# Altium project ArduinoProMini_Project.PrjPcb
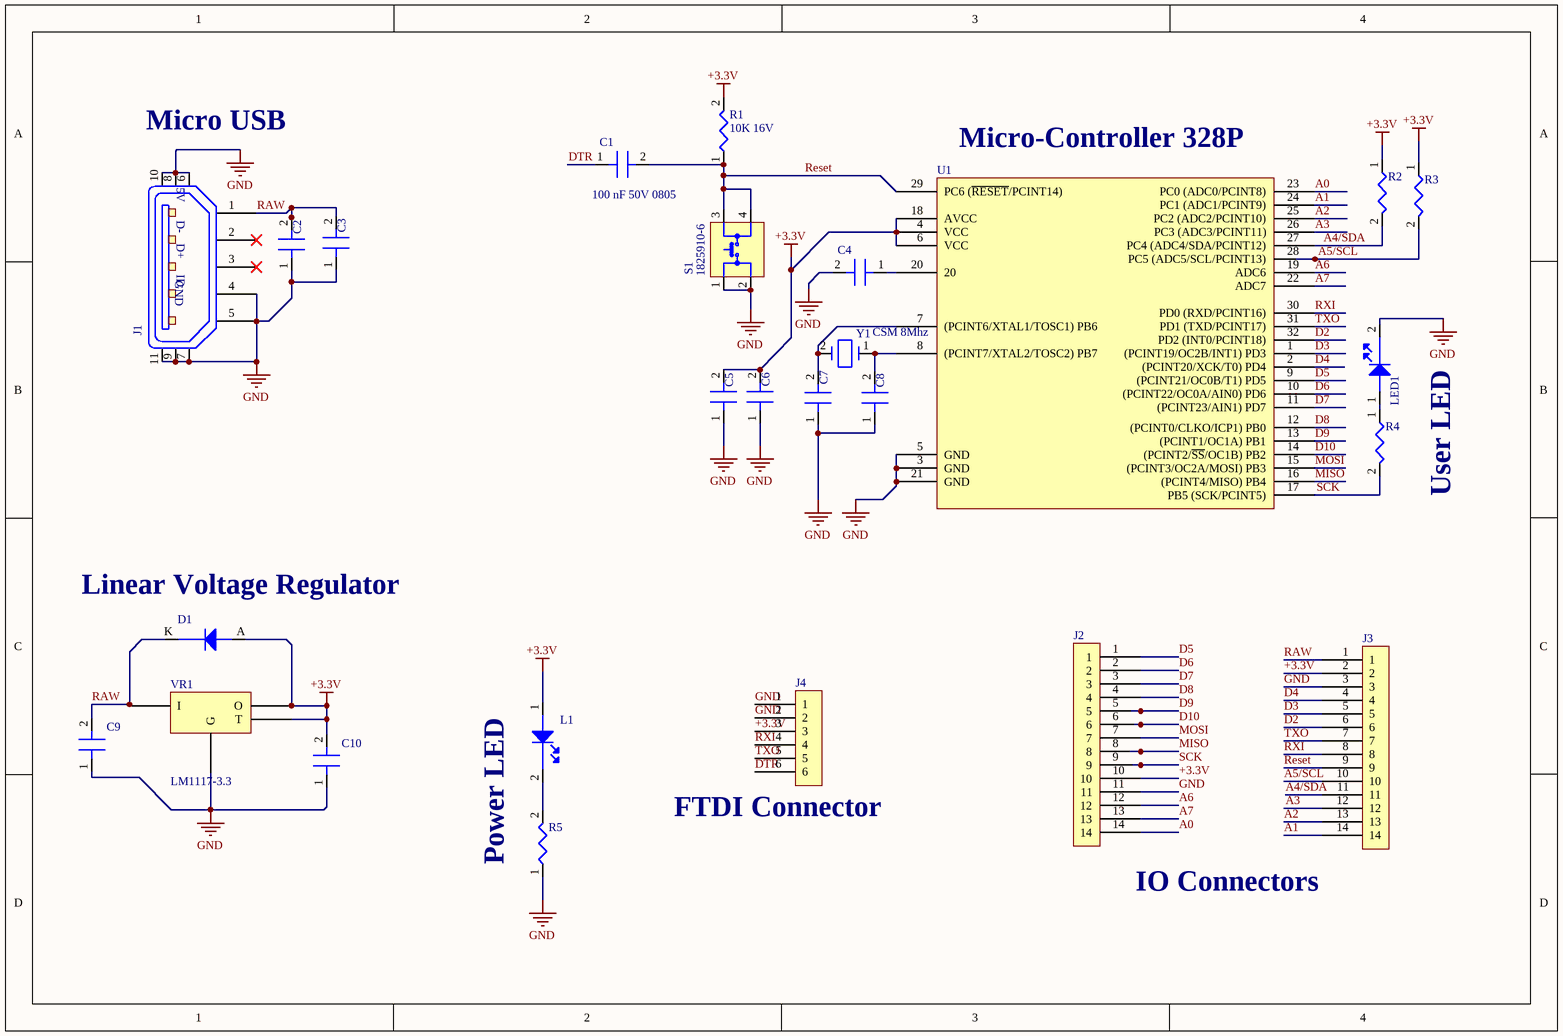
[diagram p0: ArduinoProMini_Schematic.SchDoc]
1 sheet, 26 parts. Net scope: global (net labels, ports and power ports of the same name join across sheets).
Board file: ArduinoProMini_PCB.PcbDoc

## Sheet ArduinoProMini_Schematic.SchDoc
size A4; SheetNumber: 1; SheetTotal: 1

### Parts
C1  100 nF 50V 0805  [C 0805]
C2  100nF  [C 0805]  (value not drawn)
C3  100nF  [C 0805]  (value not drawn)
C4  100 nF 50V 0805  [C 0805]  (value not drawn)
C5  100 nF 50V 0805  [C 0805]  (value not drawn)
C6  100 nF 50V 0805  [C 0805]  (value not drawn)
C7  18pF  [C 0805]  (value not drawn)
C8  18pF  [C 0805]  (value not drawn)
C9  10uF 16V  [C 0805]  (value not drawn)
C10  10uF  [C 0805]  (value not drawn)
D1  1N4148  [DIode 1N4148]  (value not drawn)
J1  (no value)  [Micro-USB-Type-B-FP]
J2  Header 1*14 Male 2.54  [Header Male 1x14 2.54]  (value not drawn)
J3  Header 1*14 Male 2.54  [Header Male 1x14 2.54]  (value not drawn)
J4  Header 1*6 Female  [Header Female 1x6-254]  (value not drawn)
L1  LED Blue 0603  [LED 0603]  (value not drawn)
LED1  LED White 0603  [LED 0603]  (value not drawn)
R1  10K 16V  [R 0805]
R2  10K 16V  [R 0805]  (value not drawn)
R3  10K 16V  [R 0805]  (value not drawn)
R4  330R 150V  [R 0805]  (value not drawn)
R5  330R 150V  [R 0805]  (value not drawn)
S1  1825910-6  [SW-1825910-6]
U1  ATMEGA328P-AUR  [TQFP-32]  (value not drawn)
VR1  LM1117-3.3  [LM1117-SOT223]
Y1  CSM 8Mhz  [Crystal CSM-7X]

### Nets
+3.3V: C5.2 C6.2 C10.2 D1.A(anode) J2.10 J3.2 J4.3 L1.1(anode) R1.2 R2.1 R3.1 U1.4(VCC) U1.6(VCC) U1.18(AVCC) VR1.2(O) VR1.4(T)
GND: C2.1 C3.1 C4.2 C5.1 C6.1 C7.1 C8.1 C9.1 C10.1 J1.4 J1.5 J1.6 J1.7 J1.8 J1.9 J1.10 J1.11 J2.11 J3.3 J4.1 J4.2 LED1.2(cathode) R5.1 S1.1 S1.2 U1.3(GND) U1.5(GND) U1.21(GND) VR1.1(G)
A0: J2.14 U1.23(PC0_(ADC0/PCINT8))
A1: J3.14 U1.24(PC1_(ADC1/PCINT9))
A2: J3.13 U1.25(PC2_(ADC2/PCINT10))
A3: J3.12 U1.26(PC3_(ADC3/PCINT11))
A4/SDA: J3.11 R2.2 U1.27(PC4_(ADC4/SDA/PCINT12))
A5/SCL: J3.10 R3.2 U1.28(PC5_(ADC5/SCL/PCINT13))
A6: J2.12 U1.19(ADC6)
A7: J2.13 U1.22(ADC7)
D2: J3.6 U1.32(PD2_(INT0/PCINT18))
D3: J3.5 U1.1((PCINT19/OC2B/INT1)_PD3)
D4: J3.4 U1.2((PCINT20/XCK/T0)_PD4)
D5: J2.1 U1.9((PCINT21/OC0B/T1)_PD5)
D6: J2.2 U1.10((PCINT22/OC0A/AIN0)_PD6)
D7: J2.3 U1.11((PCINT23/AIN1)_PD7)
D8: J2.4 U1.12((PCINT0/CLKO/ICP1)_PB0)
D9: J2.5 U1.13((PCINT1/OC1A)_PB1)
D10: J2.6 U1.14((PCINT2/~{SS}/OC1B)_PB2)
DTR: C1.1 J4.6
MISO: J2.8 U1.16((PCINT4/MISO)_PB4)
MOSI: J2.7 U1.15((PCINT3/OC2A/MOSI)_PB3)
RAW: C2.2 C3.2 C9.2 D1.K(cathode) J1.1 J3.1 VR1.3(I)
Reset: C1.2 J3.9 R1.1 S1.3 S1.4 U1.29(PC6_(~{RESET}/PCINT14))
RXI: J3.8 J4.4 U1.30(PD0_(RXD/PCINT16))
SCK: J2.9 R4.2 U1.17(PB5_(SCK/PCINT5))
TXO: J3.7 J4.5 U1.31(PD1_(TXD/PCINT17))
NetC4_1: C4.1 U1.20
NetC7_2: C7.2 U1.7((PCINT6/XTAL1/TOSC1)_PB6) Y1.2
NetC8_2: C8.2 U1.8((PCINT7/XTAL2/TOSC2)_PB7) Y1.1
NetL1_2: L1.2(cathode) R5.2
NetLED1_1: LED1.1(anode) R4.1

Not connected (* = marked no-connect by the designer): J1 2* 3*

### Notes on the sheet
- (near J1) Micro USB
- (near U1) Micro-Controller 328P
- User LED
- (near D1) Linear Voltage Regulator
- (near J4) FTDI Connector
- Power LED
- IO Connectors
- (in symbol Micro-USB-Type-B-SCH) 5V; D-; D+; ID; GND

### Library data of the parts
C1 C4-C6 = C0805C104Z5VACTU: Multilayer Ceramic Capacitor, 0.1 uF, 50 V, -20%, +80%, Y5V, 0805 [2012 Metric]; Manufacturer: KEMET; Material: 4241ConductorMaterial; Value: 100nF; Tolerance: 80%; Dissipation Factor: 5%; Supplier: Digikey; Supplier Part Number: 399-C0805C104Z5VAC7800CT-ND; Manufacturer Part Number: C0805C104Z5VACTU; RoHS: Yes; Category: Ceramic Capacitors; Stock: 411669; Pricing: 1=0.1, 10=0.043, 50=0.0248, 100=0.0193, 500=0.0145, 1000=0.01139 (USD); Mounting Technology: Surface Mount,PCB; Case/Package: 0805; Pins: 2NUMBER; Case Code (Metric): 2012; Case Code (Imperial): 0805; Dielectric Material: Ceramic; Min Operating Temperature: -30°C; Max Operating Temperature: 85°C; Package Quantity: 1; Voltage Rating: 50V; Packaging: Tape and Reel; Voltage Rating (DC): 50V; Dielectric: Y5V; Termination: SMD/SMT; Voltage: 50V; Series: C0805C; Construction: Flat; Length: 2mm; Width: 0.049inch; Height: 0.9mm; Thickness: 0.039inch; Lead Pitch: 0.75mm; Depth: 1.25mm; Radiation Hardening: No; Reach SVHC Compliant: No; RoHS Compliant: Yes; Lead Free: 5697LeadFree; ComponentLink1URL: https://datasheet.ciiva.com/7842/1470417-7842543.pdf?src-supplier=Element14; ComponentLink1Description: https://datasheet.ciiva.com/7842/1470417-7842543.pdf?src-supplier=Element14; ComponentLink2URL: https://datasheet.ciiva.com/14608/70095383-14608251.pdf?src-supplier=Allied+Electronics; ComponentLink2Description: https://datasheet.ciiva.com/14608/70095383-14608251.pdf?src-supplier=Allied+Electronics; ComponentLink3URL: https://datasheet.ciiva.com/14597/70095383-14597846.pdf?src-supplier=Allied+Electronics; ComponentLink3Description: https://datasheet.ciiva.com/14597/70095383-14597846.pdf?src-supplier=Allied+Electronics; ComponentLink4URL: https://datasheet.ciiva.com/26847/getdatasheetpartid-321176-26847799.pdf?src-supplier=Verical; ComponentLink4Description: https://datasheet.ciiva.com/26847/getdatasheetpartid-321176-26847799.pdf?src-supplier=Verical
C2 C3 = C0805C104Z5VACTU: Multilayer Ceramic Capacitor, 0.1 uF, 50 V, -20%, +80%, Y5V, 0805 [2012 Metric]; Manufacturer: KEMET; Material: 4241ConductorMaterial; Voltage Rating: 50V; Tolerance: 80%; Dissipation Factor: 5%; Supplier: Digikey; Supplier Part Number: 399-C0805C104Z5VAC7800CT-ND; Manufacturer Part Number: C0805C104Z5VACTU; RoHS: Yes; Category: Ceramic Capacitors; Stock: 411669; Pricing: 1=0.1, 10=0.043, 50=0.0248, 100=0.0193, 500=0.0145, 1000=0.01139 (USD); Mounting Technology: Surface Mount,PCB; Case/Package: 0805; Pins: 2NUMBER; Case Code (Metric): 2012; Case Code (Imperial): 0805; Dielectric Material: Ceramic; Min Operating Temperature: -30°C; Max Operating Temperature: 85°C; Package Quantity: 1; Value: 100nF; Packaging: Tape and Reel; Voltage Rating (DC): 50V; Dielectric: Y5V; Termination: SMD/SMT; Voltage: 50V; Series: C0805C; Construction: Flat; Length: 2mm; Width: 0.049inch; Height: 0.9mm; Thickness: 0.039inch; Lead Pitch: 0.75mm; Depth: 1.25mm; Radiation Hardening: No; Reach SVHC Compliant: No; RoHS Compliant: Yes; Lead Free: 5697LeadFree; ComponentLink1URL: https://datasheet.ciiva.com/7842/1470417-7842543.pdf?src-supplier=Element14; ComponentLink1Description: https://datasheet.ciiva.com/7842/1470417-7842543.pdf?src-supplier=Element14; ComponentLink2URL: https://datasheet.ciiva.com/14608/70095383-14608251.pdf?src-supplier=Allied+Electronics; ComponentLink2Description: https://datasheet.ciiva.com/14608/70095383-14608251.pdf?src-supplier=Allied+Electronics; ComponentLink3URL: https://datasheet.ciiva.com/14597/70095383-14597846.pdf?src-supplier=Allied+Electronics; ComponentLink3Description: https://datasheet.ciiva.com/14597/70095383-14597846.pdf?src-supplier=Allied+Electronics; ComponentLink4URL: https://datasheet.ciiva.com/26847/getdatasheetpartid-321176-26847799.pdf?src-supplier=Verical; ComponentLink4Description: https://datasheet.ciiva.com/26847/getdatasheetpartid-321176-26847799.pdf?src-supplier=Verical
C7 C8 = CC0805JRNPO9BN180: Multilayer Ceramic Capacitor, 18 pF, 50 V, ± 5%, C0G (NP0), 0805 [2012 Metric]; Manufacturer: Yageo; Supplier: Future Electronics; Supplier Part Number: 7642911; Manufacturer Part Number: CC0805JRNPO9BN180; RoHS: Yes; Category: Ceramic Capacitors; Stock: 232000; Pricing: 4000=0.0082, 16000=0.0078, 60000=0.0075, 100000=0.0073, 200000=0.0069 (USD); Lead Free: 5697LeadFree; Halogen Free: 5694HalogenFree; ComponentLink1URL: https://datasheet.ciiva.com/26862/getdatasheetpartid-403658-26862933.pdf?src-supplier=Verical; ComponentLink1Description: https://datasheet.ciiva.com/26862/getdatasheetpartid-403658-26862933.pdf?src-supplier=Verical; ComponentLink2URL: https://datasheet.ciiva.com/144/mlccorderingcode-144754.pdf?src-supplier=Digikey; ComponentLink2Description: https://datasheet.ciiva.com/144/mlccorderingcode-144754.pdf?src-supplier=Digikey; ComponentLink3URL: https://datasheet.ciiva.com/144/mlccorderingcode-144755.pdf?src-supplier=Digikey; ComponentLink3Description: https://datasheet.ciiva.com/144/mlccorderingcode-144755.pdf?src-supplier=Digikey; ComponentLink4URL: https://datasheet.ciiva.com/144/mlccorderingcode-144756.pdf?src-supplier=Digikey; ComponentLink4Description: https://datasheet.ciiva.com/144/mlccorderingcode-144756.pdf?src-supplier=Digikey; ComponentLink5URL: https://datasheet.ciiva.com/11586/upy-gp-np0-16v-to-50v-8-11586203.pdf?src-supplier=Avnet; ComponentLink5Description: https://datasheet.ciiva.com/11586/upy-gp-np0-16v-to-50v-8-11586203.pdf?src-supplier=Avnet
C9 = C0805C106K4PACTU: Multilayer Ceramic Capacitor, 10 uF, 16 V, ± 10%, X5R, 0805 [2012 Metric]; Manufacturer: KEMET; Material: 4241ConductorMaterial; Dissipation Factor: 5%; Supplier: Digikey; Supplier Part Number: 399-C0805C106K4PAC7800CT-ND; Manufacturer Part Number: C0805C106K4PACTU; RoHS: Yes; Category: Ceramic Capacitors; Stock: 211297; Pricing: 1=0.17, 10=0.109, 50=0.069, 100=0.0553, 500=0.03992, 1000=0.03531 (USD); Mounting Technology: Surface Mount; Case/Package: 0805; Pins: 2; Dielectric Material: Ceramic; Case Code (Imperial): 0805; Case Code (Metric): 2012; Min Operating Temperature: -55°C; Max Operating Temperature: 85°C; Value: 10uF; Tolerance: 10%; Packaging: Tape and Reel; Dielectric: X5R; Voltage: 16V; Termination: SMD/SMT; Package Quantity: 1; Voltage Rating: 16V; Series: C; Construction: Flat; Voltage Rating (DC): 16V; Length: 2mm; Width: 0.049inch; Height: 1.25mm; Depth: 1.25mm; Thickness: 0.055inch; Radiation Hardening: No; Reach SVHC Compliant: No; RoHS Compliant: Yes; Lead Free: 5697LeadFree; ComponentLink1URL: https://datasheet.ciiva.com/7842/1732713-7842196.pdf?src-supplier=Element14; ComponentLink1Description: https://datasheet.ciiva.com/7842/1732713-7842196.pdf?src-supplier=Element14; ComponentLink2URL: https://datasheet.ciiva.com/28682/1831760-28682305.pdf?src-supplier=Element14; ComponentLink2Description: https://datasheet.ciiva.com/28682/1831760-28682305.pdf?src-supplier=Element14; ComponentLink3URL: https://datasheet.ciiva.com/11787/0900766b8116eb59-11787314.pdf?src-supplier=Rs; ComponentLink3Description: https://datasheet.ciiva.com/11787/0900766b8116eb59-11787314.pdf?src-supplier=Rs; ComponentLink4URL: https://datasheet.ciiva.com/7842/1732713-7842197.pdf?src-supplier=Element14; ComponentLink4Description: https://datasheet.ciiva.com/7842/1732713-7842197.pdf?src-supplier=Element14
C10 = C0805C106K4PACTU: Multilayer Ceramic Capacitor, 10 uF, 16 V, ± 10%, X5R, 0805 [2012 Metric]; Manufacturer: KEMET; Material: 4241ConductorMaterial; Voltage: 16V; Dissipation Factor: 5%; Supplier: Digikey; Supplier Part Number: 399-C0805C106K4PAC7800CT-ND; Manufacturer Part Number: C0805C106K4PACTU; RoHS: Yes; Category: Ceramic Capacitors; Stock: 211297; Pricing: 1=0.17, 10=0.109, 50=0.069, 100=0.0553, 500=0.03992, 1000=0.03531 (USD); Mounting Technology: Surface Mount; Case/Package: 0805; Pins: 2; Dielectric Material: Ceramic; Case Code (Imperial): 0805; Case Code (Metric): 2012; Min Operating Temperature: -55°C; Max Operating Temperature: 85°C; Value: 10uF; Tolerance: 10%; Packaging: Tape and Reel; Dielectric: X5R; Termination: SMD/SMT; Package Quantity: 1; Voltage Rating: 16V; Series: C; Construction: Flat; Voltage Rating (DC): 16V; Length: 2mm; Width: 0.049inch; Height: 1.25mm; Depth: 1.25mm; Thickness: 0.055inch; Radiation Hardening: No; Reach SVHC Compliant: No; RoHS Compliant: Yes; Lead Free: 5697LeadFree; ComponentLink1URL: https://datasheet.ciiva.com/7842/1732713-7842196.pdf?src-supplier=Element14; ComponentLink1Description: https://datasheet.ciiva.com/7842/1732713-7842196.pdf?src-supplier=Element14; ComponentLink2URL: https://datasheet.ciiva.com/28682/1831760-28682305.pdf?src-supplier=Element14; ComponentLink2Description: https://datasheet.ciiva.com/28682/1831760-28682305.pdf?src-supplier=Element14; ComponentLink3URL: https://datasheet.ciiva.com/11787/0900766b8116eb59-11787314.pdf?src-supplier=Rs; ComponentLink3Description: https://datasheet.ciiva.com/11787/0900766b8116eb59-11787314.pdf?src-supplier=Rs; ComponentLink4URL: https://datasheet.ciiva.com/7842/1732713-7842197.pdf?src-supplier=Element14; ComponentLink4Description: https://datasheet.ciiva.com/7842/1732713-7842197.pdf?src-supplier=Element14
D1 = 1N4148UR-1: Rectifier Diode Switching 75V 0.2A 5ns 2-Pin DO-213AA Bag; Manufacturer: Microsemi; Forward Current: 200mA; Supplier: Newark; Supplier Part Number: 34AJ8178; Manufacturer Part Number: 1N4148UR-1; RoHS: No; Category: Uncategorized; Max Repetitive Reverse Voltage (Vrrm): 75V; Reverse Recovery Time-Max: 5ns; Lead Free: Lead Free; ComponentLink1URL: https://datasheet.ciiva.com/3304/lds-0281-1-3304223.pdf?src-supplier=Avnet; ComponentLink1Description: https://datasheet.ciiva.com/3304/lds-0281-1-3304223.pdf?src-supplier=Avnet
J1 = Micro-USB-Type-B-SCH: CONN USB MICRO B RECPT SMT R/A; Manufacturer: Amphenol ICC / FCI; Manufacturer Part Number: 10118194-0001LF; Connector Type: USB,Receptacle; Number of Contacts: 5; Gender: Receptacle; Current Rating: 1.8A; Insulation Resistance: 1GR; Number of Ports: 1; Max Voltage Rating (AC): 100V; Supplier: Rs; Supplier Part Number: 1370829; RoHS: No; Category: LDO; Stock: 4420; Pricing: 1200=0.225, 2400=0.219 (EUR); Mounting Technology: Surface Mount,Horizontal; Pins: 5; Color: Black; Contact Material: Copper Alloy; Contact Plating: Gold; Housing Material: Polymer; Min Operating Temperature: -55°C; Max Operating Temperature: 85°C; Features: Shielded; Packaging: Tape and Reel; Termination: Solder; Orientation: Right Angle; Series: -; Package Quantity: 9600; Length: 8.05mm; Depth: 5mm; Flammability Rating: UL94 V-0
J2 J3 = PH1-14-UA: Conn Unshrouded Header HDR 14 POS 2.54mm Solder ST Thru-Hole Bag; Manufacturer: Adam Equipment; Number of Positions: 14; Voltage Rating (AC): 250V; Supplier: Future Electronics; Supplier Part Number: 9109416; Manufacturer Part Number: PH1-14-UA; RoHS: Yes; Category: Connectors; Stock: 12000; Pricing: 1000=0.0993, 3000=0.0952, 5000=0.0934, 15000=0.0895, 25000=0.0862 (USD); Mounting Technology: Through Hole; Contact Material: Brass; Contact Shape: Square; Contact Finish - Mating: GOLD; Insulation Material: PBT; Insulation Color: Black; Min Operating Temperature: -40°C; Max Operating Temperature: 105°C; Connector Type: Header; Fastening Type: Pull; Series: PH1; Packaging: Bulk; Contact Type: Male Pin; Number of Rows: 1; Termination: Solder; Lead Free: Lead Free; Flammability Rating: UL94 V-0; ComponentLink1URL: https://datasheet.ciiva.com/16480/catpg250-254-16480235.pdf?src-supplier=Future+Electronics; ComponentLink1Description: https://datasheet.ciiva.com/16480/catpg250-254-16480235.pdf?src-supplier=Future+Electronics
J4 = M20-7820646: 2.54mm (0.1") Pitch SIL Vertical PC Tail Socket Assembly, tin, 6 contacts; Manufacturer: Harwin; Number of Positions: 6; Voltage Rating: 1kV; Connector Type: Receptacle; Mated Stacking Heights: 12.63mm; Supplier: Rs; Supplier Part Number: 1613515; Manufacturer Part Number: M20-7820646; RoHS: Yes; Category: Headers and Wire Housings; Stock: 396; Pricing: 36=0.938, 180=0.875, 360=0.781, 720=0.704 (EUR); Mounting Technology: Through Hole; Case/Package: SIL; Contact Plating: Tin; Contact Material: Bronze; Contact Finish - Mating: TIN; Insulation Color: Black; Insulation Material: Nylon; Contact Shape: Square; Min Operating Temperature: -40°C; Max Operating Temperature: 105°C; Packaging: Rail/Tube; Number of Rows: 1; Termination: Solder; Series: M20; Package Quantity: 38; Number of Contacts: 6; Contact Type: Female Socket; Fastening Type: Pull; Contact Gender: Female; Pitch: 2.54mm; Radiation Hardening: No; RoHS Compliant: Yes; Flammability Rating: UL94 V-0; ComponentLink1URL: https://cdn.harwin.com/pdfs/Harwin_PC_Connectors_M20.pdf?src-supplier=Rs; ComponentLink1Description: https://cdn.harwin.com/pdfs/Harwin_PC_Connectors_M20.pdf?src-supplier=Rs; ComponentLink2URL: http://www.harwin.com/include/downloads/pdfs/2010PAGE120.PDF?src-supplier=Avnet; ComponentLink2Description: http://www.harwin.com/include/downloads/pdfs/2010PAGE120.PDF?src-supplier=Avnet; ComponentLink3URL: https://cdn.harwin.com/pdfs/M20-782.pdf?src-supplier=Digikey; ComponentLink3Description: https://cdn.harwin.com/pdfs/M20-782.pdf?src-supplier=Digikey; ComponentLink4URL: https://cdn.harwin.com/pdfs/Harwin_PC_Connectors_M20.pdf?src-supplier=Mouser; ComponentLink4Description: https://cdn.harwin.com/pdfs/Harwin_PC_Connectors_M20.pdf?src-supplier=Mouser; ComponentLink5URL: https://cdn.harwin.com/pdfs/Harwin_PC_Connectors_M20.pdf?src-supplier=TTI; ComponentLink5Description: https://cdn.harwin.com/pdfs/Harwin_PC_Connectors_M20.pdf?src-supplier=TTI
L1 = LTST-C194TBKT: LED BLUE CLEAR 0603 SMD; Manufacturer: Vishay Lite-On; Supplier: Rs; Supplier Part Number: 1278417; Manufacturer Part Number: LTST-C194TBKT; RoHS: Yes; Category: LEDs; Stock: 8750; Pricing: 50=0.208, 750=0.092, 1500=0.069, 3000=0.066, 6000=0.058 (EUR); ComponentLink1URL: https://datasheet.ciiva.com/2115/ltst-c194tbkt-2115056.pdf?src-supplier=Digikey; ComponentLink1Description: https://datasheet.ciiva.com/2115/ltst-c194tbkt-2115056.pdf?src-supplier=Digikey; ComponentLink2URL: https://datasheet.ciiva.com/4689/lite-on-ltst-c194tbkt-187209-4689177.pdf?src-supplier=Mouser; ComponentLink2Description: https://datasheet.ciiva.com/4689/lite-on-ltst-c194tbkt-187209-4689177.pdf?src-supplier=Mouser; ComponentLink3URL: https://datasheet.ciiva.com/2115/s-110-ltst-c194tbkt-2115057.pdf?src-supplier=Digikey; ComponentLink3Description: https://datasheet.ciiva.com/2115/s-110-ltst-c194tbkt-2115057.pdf?src-supplier=Digikey
LED1 = IN-S63AT5UW: SMD LED - Mono Color Top View, 0603 0.40mm LED PCB Type, White, High Brightness, Clear Lens, Angle 120; Manufacturer: Inolux; Lens Style: Flat; Luminous Intensity: 900mcd; Forward Voltage: 3V; Test Current: 5mA; Viewing Angle: 120°; Power Dissipation: 75mW; Reverse Voltage: 5V; Lens Size: 0.8mm; Supplier: Mouser; Supplier Part Number: 743-IN-S63AT5UW; Manufacturer Part Number: IN-S63AT5UW; RoHS: Yes; Category: LEDs; Stock: 170396; Pricing: 1=0.33, 10=0.177, 50=0.177, 100=0.076, 1000=0.059, 10000=0.044 (USD); Mounting Technology: Surface Mount; Case/Package: 0603; Color: White; Lens Color: Clear; Case Code (Imperial): 0603; Case Code (Metric): 1608; Min Operating Temperature: -40°C; Max Operating Temperature: 85°C; Packaging: Tape and Reel; Lens Transparency: Clear; Forward Current: 5mA; Length: 1.6mm; Width: 0.8mm; Height: 0.4mm; ComponentLink1URL: http://www.inolux-corp.com/datasheet/SMDLED/Mono%20Color%20Top%20View/IN-S63AT%20Series_V1.1.pdf?src-supplier=Digikey; ComponentLink1Description: http://www.inolux-corp.com/datasheet/SMDLED/Mono%20Color%20Top%20View/IN-S63AT%20Series_V1.1.pdf?src-supplier=Digikey
R1-R3 = RC0805FR-0710KL: SMD Chip Resistor, 10 kOhm, ± 1%, 125 mW, 0805 [2012 Metric], Thick Film, General Purpose; Manufacturer: Yageo; Value: 10kR; Temperature Coefficient: 100ppm/°C; Power Rating: 125mW; Voltage Rating: 150V; Supplier: Future Electronics; Supplier Part Number: 3310877; Manufacturer Part Number: RC0805FR-0710KL; RoHS: Yes; Category: Chip SMD Resistors; Stock: 1020000; Pricing: 5000=0.004, 25000=0.0038, 150000=0.0035, 500000=0.0034, 1500000=0.0031 (USD); Case/Package: 0805; Case Code (Imperial): 0805; Case Code (Metric): 2012; Min Operating Temperature: -55°C; Max Operating Temperature: 155°C; Packaging: Tape and Reel; Tolerance: 1%; Resistor Type: Thick Film; Package Quantity: 1; Termination: SMD/SMT; Number of Terminations: 2; Max Power Dissipation: 125mW; Features: Moisture Resistant; Series: RC; Construction: Rectangular; Resistance Tolerance: 1%; Technology: THICK FILM; Voltage Rating (AC): 150V; Length: 0.079inch; Width: 0.049inch; Height: 0.024inch; Depth: 1.25mm; Lead Free: Lead Free; Reach SVHC Compliant: Unknown; Military Standard: Not; RoHS Compliant: Yes; ComponentLink1URL: https://datasheet.ciiva.com/2456/pyu-r-int-thick-7-2456973.pdf?src-supplier=Digikey; ComponentLink1Description: https://datasheet.ciiva.com/2456/pyu-r-int-thick-7-2456973.pdf?src-supplier=Digikey; ComponentLink2URL: https://datasheet.ciiva.com/2456/pyu-r-int-thick-7-2456974.pdf?src-supplier=Digikey; ComponentLink2Description: https://datasheet.ciiva.com/2456/pyu-r-int-thick-7-2456974.pdf?src-supplier=Digikey; ComponentLink3URL: https://datasheet.ciiva.com/12669/rc0805-12669688.pdf?src-supplier=Mouser; ComponentLink3Description: https://datasheet.ciiva.com/12669/rc0805-12669688.pdf?src-supplier=Mouser; ComponentLink4URL: https://datasheet.ciiva.com/16747/rc0805-16747087.pdf?src-supplier=Future+Electronics; ComponentLink4Description: https://datasheet.ciiva.com/16747/rc0805-16747087.pdf?src-supplier=Future+Electronics
R4 R5 = RC0805JR-07330RL: SMD Chip Resistor, 330 Ohm, ± 5%, 125 mW, 0805 [2012 Metric], Thick Film, General Purpose; Manufacturer: Yageo; Supplier: Future Electronics; Supplier Part Number: 7136500; Manufacturer Part Number: RC0805JR-07330RL; RoHS: Yes; Category: Chip SMD Resistors; Stock: 415000; Pricing: 5000=0.0037, 25000=0.0034, 125000=0.0032, 250000=0.0031, 750000=0.0029 (USD); Voltage Rating (AC): 150V; ComponentLink1URL: https://datasheet.ciiva.com/12555/rc0805-257173-12555078.pdf?src-supplier=Mouser; ComponentLink1Description: https://datasheet.ciiva.com/12555/rc0805-257173-12555078.pdf?src-supplier=Mouser; ComponentLink2URL: https://datasheet.ciiva.com/46395/444164-46395119.pdf?src-supplier=Element14; ComponentLink2Description: https://datasheet.ciiva.com/46395/444164-46395119.pdf?src-supplier=Element14; ComponentLink3URL: https://datasheet.ciiva.com/7941/442941-7941941.pdf?src-supplier=Element14; ComponentLink3Description: https://datasheet.ciiva.com/7941/442941-7941941.pdf?src-supplier=Element14; ComponentLink4URL: https://datasheet.ciiva.com/7941/442941-7941942.pdf?src-supplier=Element14; ComponentLink4Description: https://datasheet.ciiva.com/7941/442941-7941942.pdf?src-supplier=Element14; ComponentLink5URL: https://datasheet.ciiva.com/17008/rc0805-17008395.pdf?src-supplier=Future+Electronics; ComponentLink5Description: https://datasheet.ciiva.com/17008/rc0805-17008395.pdf?src-supplier=Future+Electronics
S1 = 1825910-6: Alcoswitch, Switch, Pushbutton, Tactile, SPST, 50mA, Thru Hole, 6mm | TE Connectivity FSM4JH; Manufacturer: TE Connectivity Alcoswitch; Mechanical Life: 100000Cycles; Actuator Material: PBT; Operating Force: 160gf; Max Voltage Rating (DC): 24V; Illumination Type: Non-Illuminated,Illuminated; Switch Travel: 0.25mm; Switch Function: Off-Mom; Actuator Type: Standard; Insulation Resistance: 100MR; Number of Positions: 2NUMBER; Actuator Length: 0.055inch; Supplier: Future Electronics; Supplier Part Number: 9026957; Manufacturer Part Number: 1825910-6; RoHS: Yes; Category: Pushbutton Switches; Stock: 109532; Pricing: 1=0.0732, 750=0.0703, 2500=0.0673, 7500=0.0647, 25000=0.0596 (USD); Mounting Technology: Through Hole; Color: 46Colour; Contact Material: Copper Alloy; Contact Plating: Silver; Material: 4261ConductorMaterial; Min Operating Temperature: -35°C; Max Operating Temperature: 85°C; Max Current Rating: 50mA; Packaging: Loose Piece; Series: FSMJ; Throw Configuration: SPST; Termination: PC Pins; Contact Current Rating: 50mA; Type: Switch; Current Rating: 50mA; Length: 5.99mm; Width: 6mm; RoHS Compliant: Yes; ELV: Compliant; Lead Free: Lead Free; Reach SVHC Compliant: Unknown; ComponentLink1URL: https://datasheet.ciiva.com/30199/1825910-6rqpn1825910-6-30199520.pdf?src-supplier=Onlinecomponents.com; ComponentLink1Description: https://datasheet.ciiva.com/30199/1825910-6rqpn1825910-6-30199520.pdf?src-supplier=Onlinecomponents.com; ComponentLink2URL: https://datasheet.ciiva.com/15184/getdatasheetpartid-395915-15184509.pdf?src-supplier=Verical; ComponentLink2Description: https://datasheet.ciiva.com/15184/getdatasheetpartid-395915-15184509.pdf?src-supplier=Verical
U1 = ATMEGA328P-AUR: 1.8V~5.5V AVR 2MHz 23 TQFP-32 Microcontroller Units (MCUs/MPUs/SOCs) ROHS; Manufacturer: Microchip; Interface: I2C,SPI,UART,USART; Oscillator Type: Internal; Memory Format: FLASH; Memory Size: 32KB; Peripherals: Brown-out Detect/Reset,POR,PWM,WDT; Number of I/Os: 23; Core Architecture: PIC; Data Bus Width: 8b; Clock Frequency: 20MHz; Max Supply Voltage: 5.5V; Min Supply Voltage: 1.8V; Number of ADC Channels: 8NUMBER; Number of I2C Channels: 1NUMBER; Number of Programmable I/O: 23NUMBER; Number of PWM Channels: 6NUMBER; Number of SPI Channels: 2NUMBER; Number of Timers/Counters: 3NUMBER; RAM Size: 2KB; Watchdog Timer: 5512WatchdogTimer; Supplier: Rs; Supplier Part Number: 1773264P; Manufacturer Part Number: ATMEGA328P-AUR; RoHS: Yes; Category: Microcontrollers; Stock: 1655; Pricing: 25=2.466, 100=2.376 (EUR); Mounting Technology: Surface Mount; Case/Package: TQFP; Pins: 32; Contact Plating: 154ConductorMaterial; Min Operating Temperature: -40°C; Max Operating Temperature: 85°C; Packaging: Cut Tape; Series: PIC® 18F; Number of UART Channels: 1NUMBER; Height: 1.2mm; RoHS Compliant: Yes; Lead Free: 5697LeadFree; Reach SVHC Compliant: 4186SVHC; ComponentLink1URL: http://www.farnell.com/datasheets/2047852.pdf?src-supplier=Farnell; ComponentLink1Description: http://www.farnell.com/datasheets/2047852.pdf?src-supplier=Farnell; ComponentLink2URL: http://components.arrow.com/part/dataview/48719204S8832641N3744?src-supplier=Arrow+Electronics; ComponentLink2Description: http://components.arrow.com/part/dataview/48719204S8832641N3744?src-supplier=Arrow+Electronics; ComponentLink3URL: http://www.produktinfo.conrad.com/datenblaetter/1200000-1299999/001267077-da-01-en-IC_MCU_8BIT_3_ATMEGA328P_AUR_TQFP_32_ATM.pdf?src-supplier=Conrad; ComponentLink3Description: http://www.produktinfo.conrad.com/datenblaetter/1200000-1299999/001267077-da-01-en-IC_MCU_8BIT_3_ATMEGA328P_AUR_TQFP_32_ATM.pdf?src-supplier=Conrad; ComponentLink4URL: https://datasheet.octopart.com/ATMEGA328P-AUR-Microchip-datasheet-14421303.pdf?src-supplier=Newark; ComponentLink4Description: https://datasheet.octopart.com/ATMEGA328P-AUR-Microchip-datasheet-14421303.pdf?src-supplier=Newark; ComponentLink5URL: http://www.farnell.com/datasheets/2047852.pdf?src-supplier=Element14; ComponentLink5Description: http://www.farnell.com/datasheets/2047852.pdf?src-supplier=Element14; ComponentLink6URL: https://datasheet.octopart.com/ATMEGA328P-AUR-Microchip-datasheet-101746195.pdf?src-supplier=Future+Electronics; ComponentLink6Description: https://datasheet.octopart.com/ATMEGA328P-AUR-Microchip-datasheet-101746195.pdf?src-supplier=Future+Electronics; ComponentLink7URL: http://www.farnell.com/datasheets/1693866.pdf?src-supplier=Newark; ComponentLink7Description: http://www.farnell.com/datasheets/1693866.pdf?src-supplier=Newark; ComponentLink8URL: https://datasheet.octopart.com/ATMEGA328P-AUR-Microchip-datasheet-133520744.pdf?src-supplier=LKR; ComponentLink8Description: https://datasheet.octopart.com/ATMEGA328P-AUR-Microchip-datasheet-133520744.pdf?src-supplier=LKR; ComponentLink9URL: https://datasheet.octopart.com/ATMEGA328P-AUR-Microchip-datasheet-154741723.pdf?src-supplier=Electro+Sonic; ComponentLink9Description: https://datasheet.octopart.com/ATMEGA328P-AUR-Microchip-datasheet-154741723.pdf?src-supplier=Electro+Sonic
VR1 = LM1117MPX-3.3/NOPB: Positive Voltage Regulator, LDO, 3.3V, 0.8A, 1%, 1.2V dropout, 0÷125°C; LM1117MPX-3.3/NOPB; Manufacturer: Texas Instruments; Min Current Limit: 800mA; Number of Channels: 1NUMBER; Supplier: Mouser; Supplier Part Number: 926-LM1117MPX3.3NOPB; Manufacturer Part Number: LM1117MPX-3.3/NOPB; RoHS: Yes; Category: Voltage Regulators - Linear; Stock: 56928; Pricing: 1=1.09, 10=0.882, 50=0.882, 100=0.683, 1000=0.501, 10000=0.432 (USD); Thickness: 1.6mm; Radiation Hardening: 5898YesNo; Lead Free: 5697LeadFree; ComponentLink1URL: https://datasheet.ciiva.com/49027/1882372-49027926.pdf?src-supplier=Element14; ComponentLink1Description: https://datasheet.ciiva.com/49027/1882372-49027926.pdf?src-supplier=Element14
Y1 = ECS-80-18-5PX-TR: Crystal 8MHz ±30ppm (Tol) ±50ppm (Stability) 18pF FUND 60Ohm 2-Pin HC-49/USX SMD T/R; Manufacturer: ECS International; Supplier: Avnet; Supplier Part Number: ECS-80-18-5PX-TR; Manufacturer Part Number: ECS-80-18-5PX-TR; RoHS: Yes; Category: Crystals; Stock: 32000; Pricing: 1000=0.2205, 2000=0.2205, 4000=0.2205, 6000=0.1911, 8000=0.1911, 250000=0.1617, 500000=0.1617, 1000000=0.1617 (USD); ComponentLink1URL: https://datasheet.ciiva.com/852/csm-7x-852380.pdf?src-supplier=Digikey; ComponentLink1Description: https://datasheet.ciiva.com/852/csm-7x-852380.pdf?src-supplier=Digikey; ComponentLink2URL: https://datasheet.ciiva.com/852/csm-7x-852381.pdf?src-supplier=Digikey; ComponentLink2Description: https://datasheet.ciiva.com/852/csm-7x-852381.pdf?src-supplier=Digikey; ComponentLink3URL: https://datasheet.ciiva.com/852/csm-7x-852382.pdf?src-supplier=Digikey; ComponentLink3Description: https://datasheet.ciiva.com/852/csm-7x-852382.pdf?src-supplier=Digikey